# EAGLE schematic Align_Canbus_Core (EAGLE 9.2.1)
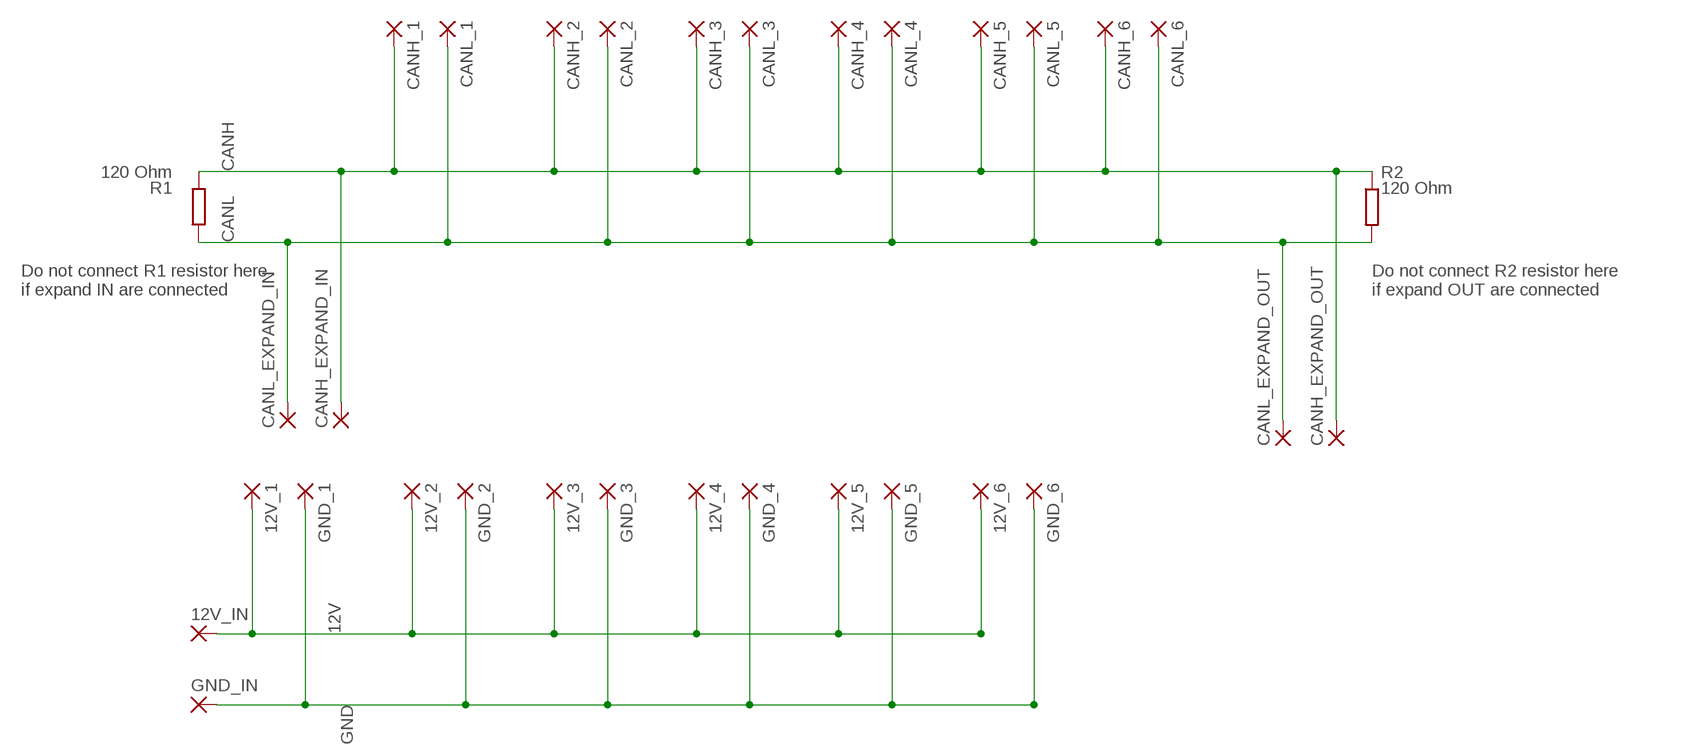
[diagram p0: schematic, sheet 1]

## Parts
12V_1  2,15/1,0  [2,15/1,0]
12V_2  2,15/1,0  [2,15/1,0]
12V_3  2,15/1,0  [2,15/1,0]
12V_4  2,15/1,0  [2,15/1,0]
12V_5  2,15/1,0  [2,15/1,0]
12V_6  2,15/1,0  [2,15/1,0]
12V_IN  3,81/1,4  [3,81/1,4]
CANH_1  2,15/1,0  [2,15/1,0]
CANH_2  2,15/1,0  [2,15/1,0]
CANH_3  2,15/1,0  [2,15/1,0]
CANH_4  2,15/1,0  [2,15/1,0]
CANH_5  2,15/1,0  [2,15/1,0]
CANH_6  2,15/1,0  [2,15/1,0]
CANH_EXPAND_IN  2,54/1,0  [2,54/1,0]
CANH_EXPAND_OUT  2,54/1,0  [2,54/1,0]
CANL_1  2,15/1,0  [2,15/1,0]
CANL_2  2,15/1,0  [2,15/1,0]
CANL_3  2,15/1,0  [2,15/1,0]
CANL_4  2,15/1,0  [2,15/1,0]
CANL_5  2,15/1,0  [2,15/1,0]
CANL_6  2,15/1,0  [2,15/1,0]
CANL_EXPAND_IN  2,54/1,0  [2,54/1,0]
CANL_EXPAND_OUT  2,54/1,0  [2,54/1,0]
GND_1  2,15/1,0  [2,15/1,0]
GND_2  2,15/1,0  [2,15/1,0]
GND_3  2,15/1,0  [2,15/1,0]
GND_4  2,15/1,0  [2,15/1,0]
GND_5  2,15/1,0  [2,15/1,0]
GND_6  2,15/1,0  [2,15/1,0]
GND_IN  3,81/1,4  [3,81/1,4]
R1  120 Ohm  RR0603  [R0603]
R2  120 Ohm  RR0603  [R0603]

## Nets
12V: 12V_6.1(P) 12V_IN.1(P)
CANH: CANH_1.1(P) CANH_2.1(P) CANH_3.1(P) CANH_4.1(P) CANH_5.1(P) CANH_6.1(P) CANH_EXPAND_IN.1(P) CANH_EXPAND_OUT.1(P) R1.2 R2.1
CANH1: 12V_1.1(P) 12V_2.1(P) 12V_3.1(P) 12V_5.1(P)
CANL: CANL_1.1(P) CANL_2.1(P) CANL_3.1(P) CANL_4.1(P) CANL_5.1(P) CANL_6.1(P) CANL_EXPAND_IN.1(P) CANL_EXPAND_OUT.1(P) R1.1 R2.2
CANL1: GND_1.1(P) GND_2.1(P) GND_3.1(P) GND_5.1(P)
GND: GND_6.1(P) GND_IN.1(P)
N$1: GND_4.1(P)
N$2: 12V_4.1(P)

## Notes on the sheet
- Do not connect R1 resistor here
  if expand IN are connected
- Do not connect R2 resistor here
  if expand OUT are connected

## Library data of the parts
12V_1-12V_6 CANH_1-CANH_6 CANL_1-CANL_6 GND_1-GND_6 = wirepad:2,15/1,0: THROUGH-HOLE PAD
12V_IN GND_IN = wirepad:3,81/1,4: THROUGH-HOLE PAD
CANH_EXPAND_IN CANH_EXPAND_OUT CANL_EXPAND_IN CANL_EXPAND_OUT = wirepad:2,54/1,0: THROUGH-HOLE PAD
R1 R2 = eagle-ltspice:R: RESISTOR, European symbol; SPICEMODEL: NONE; SPICEPREFIX: R